# EAGLE design ThunderBolt Nova Pico (EAGLE 7.5.0)
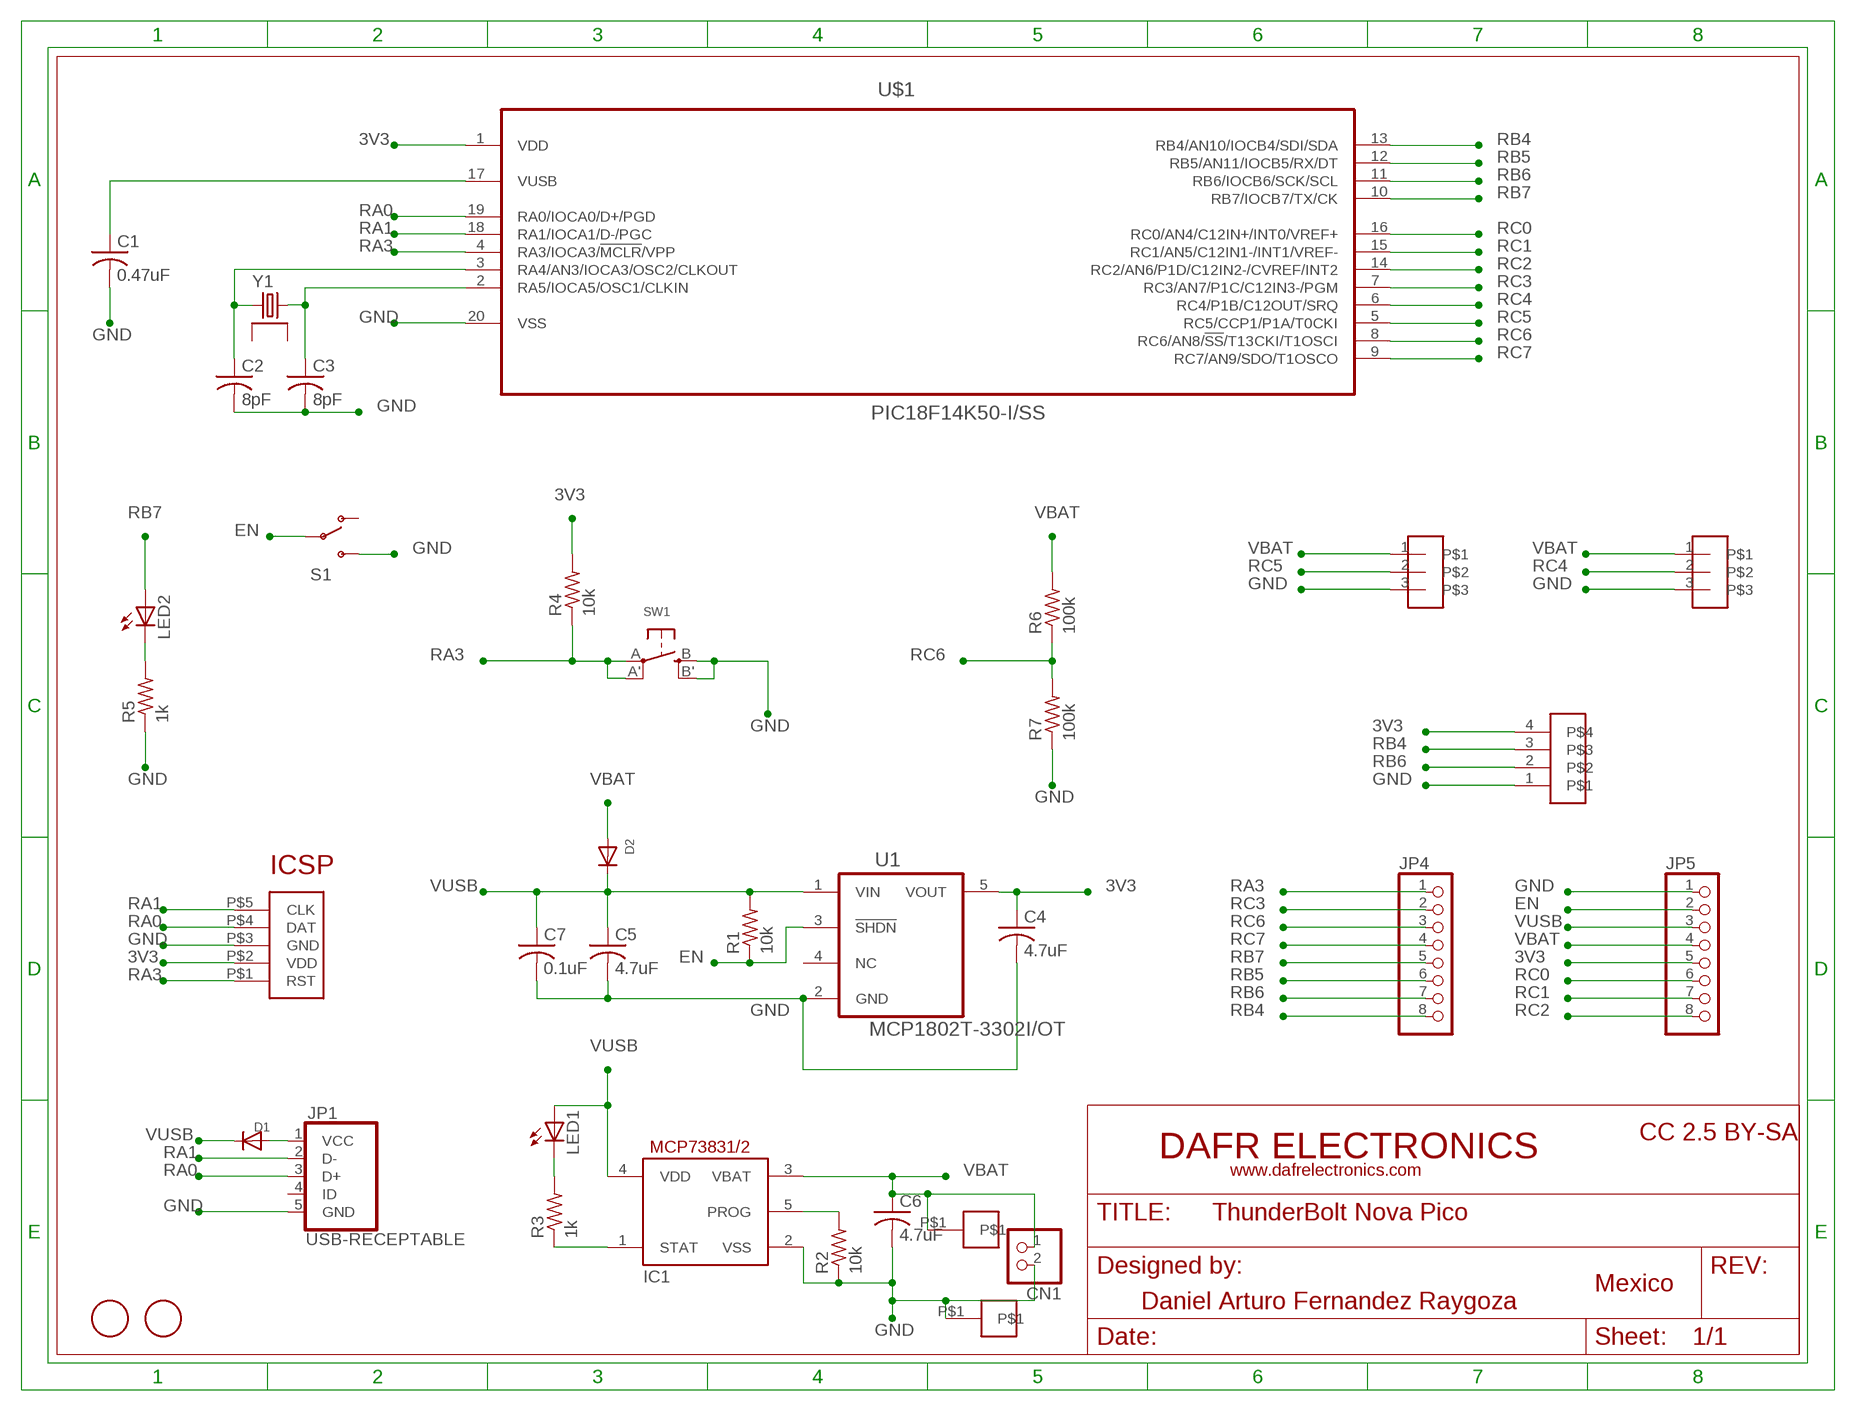
[diagram p0: schematic, sheet 1]

## Parts
C1  0.47uF  C-USC0805K  [C0805K]
C2  8pF  C-USC0805K  [C0805K]
C3  8pF  C-USC0805K  [C0805K]
C4  4.7uF  C-USC0805K  [C0805K]
C5  4.7uF  C-USC0805K  [C0805K]
C6  4.7uF  C-USC0805K  [C0805K]
C7  0.1uF  C-USC0603K  [C0603K]
CN1  JST_2PIN-SMT-RA  [JST-PH-2-SMT-RA]
D1  DIODESOD-123  [SOD-123]
D2  DIODESOD-123  [SOD-123]
IC1  MCP73831/OT  [SOT23-5L]
JP1  USB-RECEPTABLE  [FCI-10103594-0001LF]
JP4  PINHD-1X8BIG  [1X08-BIG]
JP5  PINHD-1X8BIG  [1X08-BIG]
LED1  LEDCHIPLED_1206  [CHIPLED_1206]
LED2  LEDCHIPLED_1206  [CHIPLED_1206]
R1  10k  R-US_R0805  [R0805]
R2  10k  R-US_R0805  [R0805]
R3  1k  R-US_R0805  [R0805]
R4  10k  R-US_R0805  [R0805]
R5  1k  R-US_R0805  [R0805]
R6  100k  R-US_R0805  [R0805]
R7  100k  R-US_R0805  [R0805]
S1  SWITCH-SPDT-SMD-A  [SWITCH-SPST-SMD-A]
SW1  SWITCH_TACT_SMT4.6X2.8  [BTN_KMR2_4.6X2.8]
U1  MCP1802T-3302I/OT  [SOT95P270X145-5N]
U$1  PIC18F14K50-I/SS  [SOP65P780X200-20N]
U$2  ICSP_POGO  [ICSP_POGO]
U$3  PADSMD  [PADSMD]
U$4  PADSMD  [PADSMD]
U$5  PIN1X3  [PIN1X3]
U$6  PIN1X3  [PIN1X3]
U$7  PIN1X4  [PIN1X4]
U$8  FIDUCIAL  [FIDUCIAL_1MM]
U$9  FIDUCIAL  [FIDUCIAL_1MM]
Y1  GRX-330  [OSC3225]

## Nets
3V3: C4.1 JP5.5 R4.2 U1.5(VOUT) U$1.1(VDD) U$2.P$2(VDD) U$7.4
EN: JP5.2 R1.1 S1.2(P) U1.3(!SHDN)
GND: C1.2 C2.2 C3.2 C4.2 C5.2 C6.2 C7.2 CN1.2 IC1.2(VSS) JP1.5(GND) JP5.1 R2.1 R5.1 R7.1 S1.3(S) SW1.B'(S1) SW1.B(S) U1.2(GND) U$1.20(VSS) U$2.P$3(GND) U$3.P$1 U$5.3 U$6.3 U$7.1
N$4: C1.1 U$1.17(VUSB)
N$6: C2.1 U$1.3(RA4/AN3/IOCA3/OSC2/CLKOUT) Y1.P$1
N$7: C3.1 U$1.2(RA5/IOCA5/OSC1/CLKIN) Y1.P$3
N$8: D1.A JP1.1(VCC)
N$11: IC1.1(STAT) R3.1
N$12: LED1.C R3.2
N$14: IC1.5(PROG) R2.2
N$15: LED2.C R5.2
RA0: JP1.3(D+) U$1.19(RA0/IOCA0/D+/PGD) U$2.P$4(DAT)
RA1: JP1.2(D-) U$1.18(RA1/IOCA1/D-/PGC) U$2.P$5(CLK)
RA3: JP4.1 R4.1 SW1.A'(P1) SW1.A(P) U$1.4(RA3/IOCA3/!MCLR!/VPP) U$2.P$1(RST)
RB4: JP4.8 U$1.13(RB4/AN10/IOCB4/SDI/SDA) U$7.3
RB5: JP4.6 U$1.12(RB5/AN11/IOCB5/RX/DT)
RB6: JP4.7 U$1.11(RB6/IOCB6/SCK/SCL) U$7.2
RB7: JP4.5 LED2.A U$1.10(RB7/IOCB7/TX/CK)
RC0: JP5.6 U$1.16(RC0/AN4/C12IN+/INT0/VREF+)
RC1: JP5.7 U$1.15(RC1/AN5/C12IN1-/INT1/VREF-)
RC2: JP5.8 U$1.14(RC2/AN6/P1D/C12IN2-/CVREF/INT2)
RC3: JP4.2 U$1.7(RC3/AN7/P1C/C12IN3-/PGM)
RC4: U$1.6(RC4/P1B/C12OUT/SRQ) U$5.2
RC5: U$1.5(RC5/CCP1/P1A/T0CKI) U$6.2
RC6: JP4.3 R6.1 R7.2 U$1.8(RC6/AN8/!SS!/T13CKI/T1OSCI)
RC7: JP4.4 U$1.9(RC7/AN9/SDO/T1OSCO)
VBAT: C6.1 CN1.1 D2.A IC1.3(VBAT) JP5.4 R6.2 U$4.P$1 U$5.1 U$6.1
VUSB: C5.1 C7.1 D1.C D2.C IC1.4(VDD) JP5.3 LED1.A R1.2 U1.1(VIN)
Unconnected: JP1.4(ID) S1.1(O) U1.4(NC) Y1.P$2 Y1.P$4

## Library data of the parts
C1-C7 = adafruit:C-US: CAPACITOR, American symbol
CN1 = adafruit:JST_2PIN: JST 2-Pin Connectors of various flavors SMT-RA (S2B-PH-SM4) 4UConnector #17311 SMT (B2B-PH-SM4) THM-RA (S2B-PH) THM (B2B-PH)
D1 D2 = adafruit:DIODE: Diode SMADIODE - SMA Surface Mount Package 20V 1A Schottky Diode Digikey: 641-1014-6-ND DO-1N4148 - Through Hole Small Current Diode SOD-123 20V 1 A (.5mV Vf) Schottky Diode - Digikey: MBRX120TPMSCT-ND SOD-323 10V 570mA (.38mV Vf, 3ns) Schottky Diode - Digikey: ZLLS410CT-ND SOD-523 30V 30mA Schottky Diode (RB751S-40TE61) - Digikey: RB751S-40TE61CT-ND SOT23-R/W - SOT23 Package (R = Solder Paste/Reflow Ovens, W = Hand-Soldering) BAT54Film 40V 300mA - Digikey: 497-7162-1-ND
IC1 = adafruit:MCP73831: MCP73831/2 Miniature Single-Cell, Fully Integrated Li-Ion, Li-Polymer Charge Management Controllers. Nice and small simple lipoly charge controller, with adjustable current and status output (LED) http://www.ladyada.net/library/pcb/eaglelibrary.html
JP1 = daspilker:USB-RECEPTABLE: USB Receptable
JP4 JP5 = adafruit:PINHD-1X8: PIN HEADER
LED1 LED2 = adafruit:LED: LED OSRAM: - CHIPLED LG R971, LG N971, LY N971, LG Q971, LY Q971, LO R971, LY R971 LH N974, LH R974 LS Q976, LO Q976, LY Q976 LO Q996 - Hyper CHIPLED LW Q18S LB Q993, LB Q99A, LB R99A - SideLED LS A670, LO A670, LY A670, LG A670, LP A670 LB A673, LV A673, LT A673, LW A673 LH A674 LY A675 LS A676, LA A676, LO A676, LY A676, LW A676 LS A679, LY A679, LG A679 - Hyper Micro SIDELED® LS Y876, LA Y876, LO Y876, LY Y876 LT Y87S - SmartLED LW L88C, LW L88S LB L89C, LB L89S, LG L890 LS L89K, LO L89K, LY L89K LS L896, LA L896, LO L896, LY L896 - TOPLED LS T670, LO T670, LY T670, LG T670, LP T670 LSG T670, LSP T670, LSY T670, LOP T670, LYG T670 LG T671, LOG T671, LSG T671 LB T673, LV T673, LT T673, LW T673 LH T674 LS T676, LA T676, LO T676, LY T676, LB T676, LH T676, LSB T676, LW T676 LB T67C, LV T67C, LT T67C, LS T67K, LO T67K, LY T67K, LW E67C LS E67B, LA E67B, LO E67B, LY E67B, LB E67C, LV E67C, LT E67C LW T67C LS T679, LY T679, LG T679 LS T770, LO T770, LY T770, LG T770, LP T770 LB T773, LV T773, LT T773, LW T773 LH T774 LS E675, LA E675, LY E675, LS T675 LS T776, LA T776, LO T776, LY T776, LB T776 LHGB T686 LT T68C, LB T68C - Hyper Mini TOPLED® LB M676 - Mini TOPLED Santana® LG M470 LS M47K, LO M47K, LY M47K Source: http://www.osram.convergy.de/
R1-R7 = adafruit:R-US_: RESISTOR, American symbol
S1 = SparkFun-Electromechanical:SWITCH-SPDT: SPDT Switch Simple slide switch, Spark Fun Electronics SKU : COM-00102 DPDT SMT slide switch, AYZ0202, SWCH-08179
SW1 = microbuilder:SWITCH_TACT_SMT: SMT Tact Switches 6x6mm - Digikey: P12940SCT-ND KMR2 (4.6x2.8mm) - Digikey: 401-1426-1-ND EVQ-PQHB55 - Light Touch, 160GF (4.5x4.5mm) - Digikey: P8090SCT-ND KMT0 - KMT021 NGJ LHS (etc.) IP68/Waterproof - Digikey: CKN10289CT-ND
U1 = Microchip-MCP1802T-3302I_OT:MCP1802T-3302I/OT: 300 mA, High PSRR, Low Quiescent Current LDO, SOT23-5; MPN: MCP1802T-3302I/OT; OC_FARNELL: Unknown; OC_NEWARK: 54M4838; PACKAGE: SOT23-5; SUPPLIER: Microchip
U$1 = PIC 18F14K50:PIC18F14K50-I/SS: USB Flash Microcontrollers; MPN: PIC18F14K50-I/SS; OC_FARNELL: 1648504; OC_NEWARK: 77M3105; PACKAGE: SOP-20; SUPPLIER: Microchip
U$2 = ICSP_POGO:ICSP_POGO
U$3 U$4 = 2brobots:PADSMD
U$5 U$6 = pines 2brobots:PIN1X3
U$7 = pines 2brobots:PIN1X4
U$8 U$9 = adafruit:FIDUCIAL: For use by pick and place machines to calibrate the vision/machine, 1mm By microbuilder.eu
Y1 = golledge_full_v1-0:GRX-330: Crystal |SM| 3.2 x 2.5 mm | AT cut | Frequency Range 12 - 40 MHz AEC-Q200 qualified for automotive applications Vacuum seal for excellent long-term stability High reliability at low cost Metal lid grounded to minimise EMI Datasheet <http://www.golledge.com/docs/products/xtl_sm/grx330.htm?src=eagle>; HEIGHT: 0.8

## Board
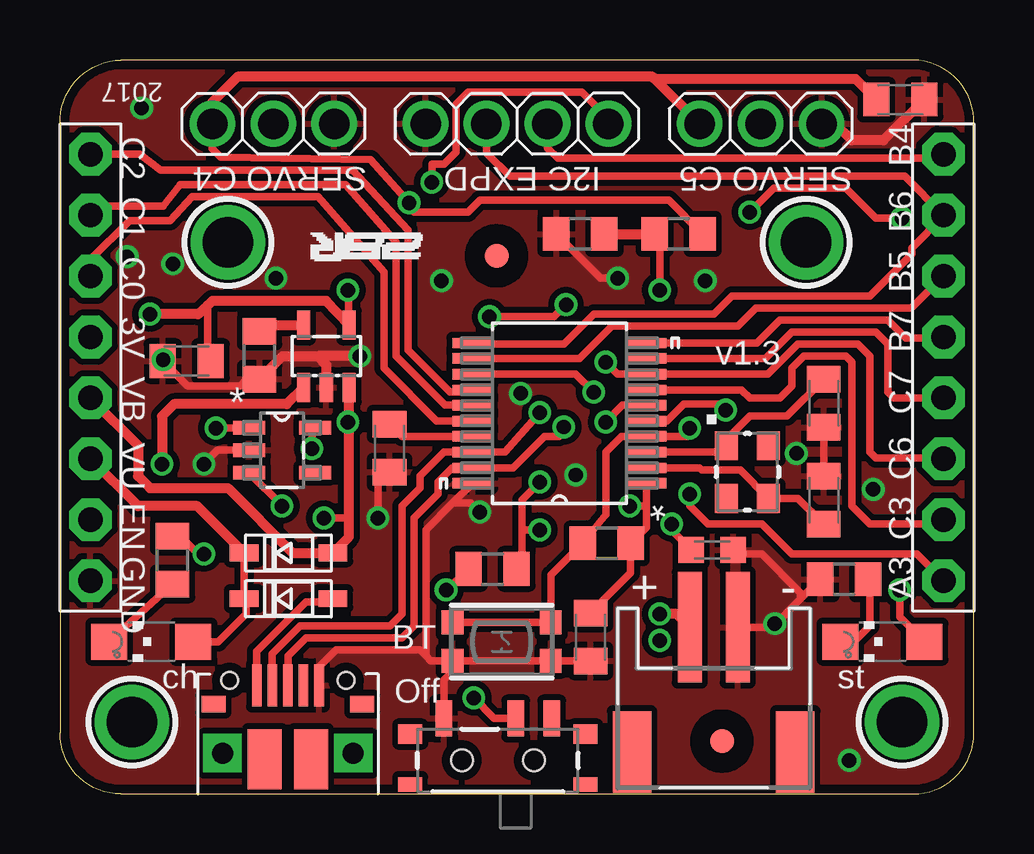
[diagram p1: board, top side]
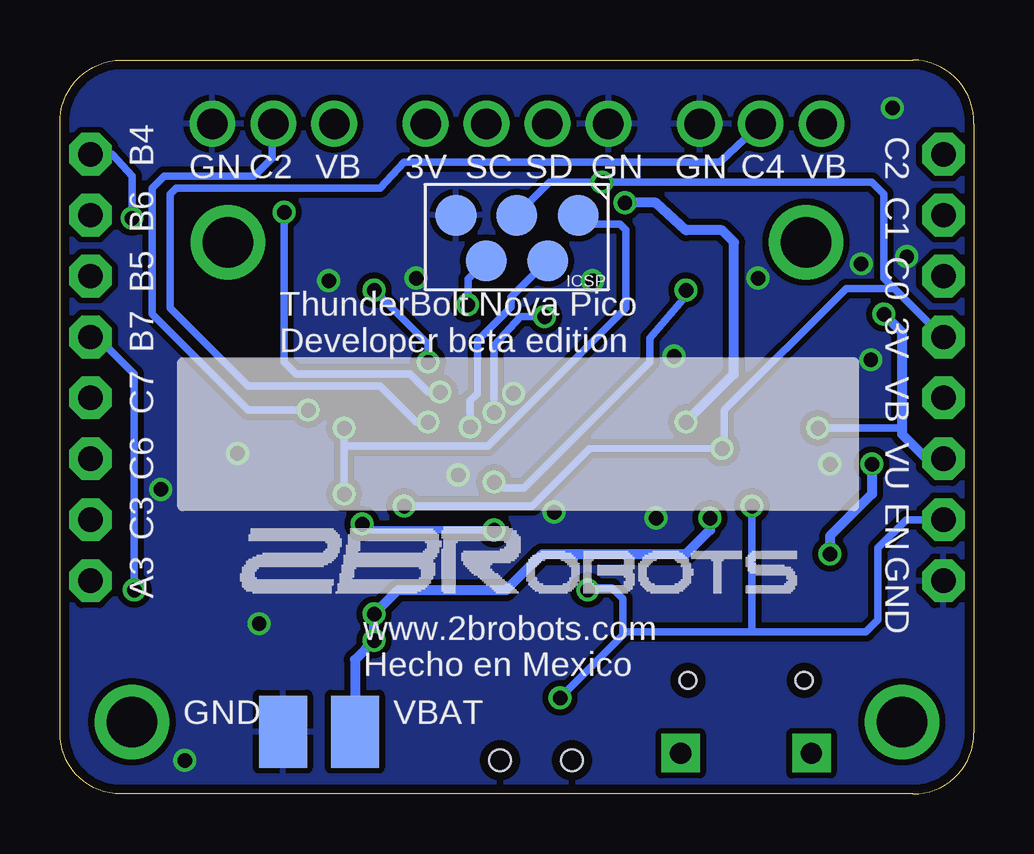
[diagram p2: board, bottom side, seen from below]

Size 38.1 x 30.6 mm. Coordinates in mm from the lower left corner, seen from the top.
Outline: 2.54,0 35.56,0 arc90 38.1,2.54 38.1,27.94 arc90 35.56,30.6 2.54,30.6 arc90 0,27.94 0,2.54 arc90 2.54,0
Copper layers (1*16): Top 0.0356mm / dielectric 1.5011mm / Bottom 0.0356mm
Design rules "oshpark-2layer *": minimum track width 6mil, minimum drill 13mil, track to track 6mil, track to pad 6mil, pad to pad 6mil, via to via 6mil, smd to smd 6mil, copper to edge 15mil, drill to drill 6mil, minimum pad ring 7mil, minimum via ring 7mil, stop-mask expansion 2.5mil, vias tented up to drill 50mil, thermal gap 10mil

### Footprints (pad centres in the part's own frame; a part is rotated, then mirrored left to right if it is on the bottom)
C0805K = smd 1.1 x 1.4: 1 -1,0; 2 1,0
C0603K = smd 1.05 x 1.08: 1 -0.875,0; 2 0.875,0
JST-PH-2-SMT-RA = smd 1 x 4.6: 1 1,-3.7; 2 -1,-3.7 | smd 1.6 x 3.4: NC1 -3.4,1.5; NC2 3.4,1.5
SOD-123 = smd 1.2 x 0.7: A 1.85,0; C -1.85,0
SOT23-5L = smd 0.55 x 1.2: 1 -0.95,-1.3; 2 0,-1.3; 3 0.95,-1.3; 4 0.95,1.3; 5 -0.95,1.3
FCI-10103594-0001LF = smd 0.4 x 1.75: 1 -1.3,4.525; 2 -0.65,4.525; 3 0,4.525; 4 0.65,4.525; 5 1.3,4.525 | smd 1 x 0.7: P$1 3.1,3.75; P$6 -3.1,3.75 | smd 1.425 x 2.5: P$2 0.963,1.45; P$5 -0.963,1.45 | drill 0.88 pad 1.6 square: P$3 -2.725,1.7; P$4 2.725,1.7 | hole 0.7: -2.425,4.73; 2.425,4.73
1X08-BIG = drill 1.016 pad 1.778 octagon: 1 -8.89,0; 2 -6.35,0; 3 -3.81,0; 4 -1.27,0; 5 1.27,0; 6 3.81,0; 7 6.35,0; 8 8.89,0
CHIPLED_1206 = smd 1.5 x 1.5: A 0,-1.75; C 0,1.75
R0805 = smd 1.1 x 1.4: 1 -1,0; 2 1,0
SWITCH-SPST-SMD-A = smd 0.7 x 1.5: 1 -2.25,-1.75; 2 -0.75,-1.75; 3 2.25,-1.75 | smd 1 x 0.6: GND1 -3.65,1; GND3 3.65,1 | smd 1 x 0.8: GND2 -3.65,-1.1; GND4 3.65,-1.1 | hole 0.9: -1.5,0; 1.5,0
BTN_KMR2_4.6X2.8 = smd 0.9 x 1: A 2.05,0.8; A' -2.05,0.8; B 2.05,-0.8; B' -2.05,-0.8
SOT95P270X145-5N = smd 1.321 x 0.559: 1 -1.372,0.94; 2 -1.372,0; 3 -1.372,-0.94; 4 1.372,-0.94; 5 1.372,0.94
SOP65P780X200-20N = smd 1.651 x 0.432: 1 -3.632,2.921; 2 -3.632,2.286; 3 -3.632,1.626; 4 -3.632,0.965; 5 -3.632,0.33; 6 -3.632,-0.33; 7 -3.632,-0.965; 8 -3.632,-1.626; 9 -3.632,-2.286; 10 -3.632,-2.921; 11 3.632,-2.921; 12 3.632,-2.286; 13 3.632,-1.626; 14 3.632,-0.965; 15 3.632,-0.33; 16 3.632,0.33; 17 3.632,0.965; 18 3.632,1.626; 19 3.632,2.286; 20 3.632,2.921
ICSP_POGO = smd 1.7 x 1.7: P$1 -2.55,0; P$2 0.01,0; P$3 2.54,0; P$4 -1.275,1.9; P$5 1.275,1.9
PADSMD = smd 2 x 3 bottom: P$1 0,0
PIN1X3 = drill 1.27: 1 -2.54,0; 2 0,0; 3 2.54,0
PIN1X4 = drill 1.27: 1 -3.81,0; 2 -1.27,0; 3 1.27,0; 4 3.81,0
FIDUCIAL_1MM = smd 1 x 1: 1 0,0
OSC3225 = smd 1.2 x 0.95: P$1 -1.1,-0.875; P$2 1.1,-0.875; P$3 1.1,0.875; P$4 -1.1,0.875

### Placement (x,y rotation side)
C1  13.74,14.42 270 top
C2  31.84,16.28 270 top
C3  31.84,12.25 90 top
C4  22.12,6.54 270 top
C5  5.28,18.05 180 top
C6  35.03,28.95 0 top
C7  27.19,10.17 0 top
CN1  27.25,3.25 180 top
D1  9.53,8.14 0 top
D2  9.53,10.04 0 top
IC1  11.1,18.25 0 top
JP1  9.5,0 0 top
JP4  36.83,17.78 90 top
JP5  1.27,17.78 90 top
LED1  3.81,6.35 90 top
LED2  34.29,6.35 90 top
R1  18.03,9.38 0 top
R2  8.32,18.29 90 top
R3  4.69,9.75 270 top
R4  22.79,10.45 0 top
R5  32.69,8.95 0 top
R6  25.79,23.35 0 top
R7  21.69,23.35 0 top
S1  18.25,1.4 180 top
SW1  18.41,6.35 0 top
U1  9.26,14.33 0 top
U$1  20.82,15.88 180 top
U$2  19.05,24.13 180 bottom
U$3  28.8,2.6 0 top
U$4  25.8,2.6 0 top
U$5  8.89,27.94 0 top
U$6  29.21,27.94 0 top
U$7  19.05,27.94 0 top
U$8  27.6,2.2 0 top
U$9  18.2,22.43 0 top
Y1  28.66,13.42 270 top

### Tracks (layer width: path | path; a pad name or v marks a point on that pad's centre or on a via)
3V3  (via drill 0.6)
  Top 0.305: 24.45,12 24.45,11.11 R4.2 23.79,9.21 C4.1 | 24.45,12 U$1.1 | U$7.4 22.86,28.14 21.75,29.25 17,29.25 16.5,28.75 16.5,26.75 16,26.25 15.5,26.25 v15.5,25.5 | U1.5 10.5,15.14 v10.5,14.4 | v23.75,12 24.45,12
  Bottom 0.305: U$2.P$2 17.69,25.5 v15.5,25.5 4.25,25.5 3.75,25 3.75,21.5 3.33,21.07 | 3.33,21.07 1.3,19.05 JP5.5 | v23.75,12 18.4,12 16,14.4 v10.5,14.4 10.5,14.75 10.4,14.85 10.4,16 5.33,21.07 3.33,21.07
EN  (via drill 0.6)
  Top 0.305: v17.25,4 18.1,3.15 S1.2 | U1.3 9.25,12.03 v9.25,12 | R1.1 16.65,9 v16.1,8.5
  Bottom 0.305: v17.25,4 14.62,6.62 | 14.62,6.62 14.5,6.75 9.25,6.75 | 9.25,6.75 4.5,6.75 4,7.25 4,10.25 2.82,11.43 JP5.2 | v9.25,12 9.25,6.75 | 14.62,6.62 14.62,8.12 15.1,8.6 15.9,8.6 v16.1,8.5
GND  (via drill 0.6)
  Top 0.305: S1.3 16,4.75 16.36,5.12 SW1.B' | SW1.B' SW1.B C4.2 | U$1.20 16.37,12.13 | 16.37,12.13 15.25,11.02 15.25,5.75 | 15.25,5.75 15.45,5.55 SW1.B' | C3.2 C2.2 | 15.25,5.75 15,6 11.5,6 10.8,5.3 JP1.5 | R5.1 30.87,8.13 | 30.87,8.13 29.69,6.95 CN1.2 | C1.2 13.25,12.93 v13.25,11.5 | v17.5,11.75 17.12,12.13 16.37,12.13 | R7.1 22.54,21.5 v23.25,21.5 | C7.2 28.23,10 29.25,10 30.87,8.38 30.87,8.13 | C5.2 5.33,17 7.5,17 7.79,17.29 R2.1 | v6,13.75 6.58,14.33 U1.2
  Top 0.406: R2.1 9.28,18.25 10.75,18.25 | 10.75,18.25 11.1,17.9 IC1.2 | v12.5,18.25 10.75,18.25 | C6.2 34.33,27.25 33,27.25 32.31,27.94 U$6.3
  other vias: 3.4,28.6 26.9,21.4 32.9,1.4 33.9,12.7 30.7,14.2 9,21.5 2.8,22.4 21.5,13.3 15.9,21.4 19.2,16.7 4.3,18.1 4.7,22.1 29.8,7.1
  pour Bottom (isolate 0.255): 0,30.48 0,0 38.1,0 38.1,30.48
  pour Top (isolate 0.255): 0,30.48 0,0 38.1,0 38.1,30.48
N$1  (via drill 2.1 pad 2.54)
  other vias: 7,23
N$2  (via drill 2.1 pad 2.54)
  other vias: 31.1,23
N$3  (via drill 2.1 pad 2.54)
  other vias: 3,3
N$4
  Top 0.305: C1.1 14.25,14.91 U$1.17
N$5  (via drill 2.1 pad 2.54)
  other vias: 35.1,3
N$6
  Top 0.305: U$1.3 27.51,14.25 Y1.P$1 27.79,14.79 28.75,15.75 30.31,15.75 C2.1
N$7
  Top 0.305: U$1.2 26.66,13.59 26.75,13.5 28.36,13.5 Y1.P$3 30.77,12.32 C3.1
N$8
  Top 0.305: D1.A 11.23,8 10.25,8 8.2,5.95 JP1.1
N$11  (via drill 0.6)
  Top 0.305: R3.1 4.94,10.5 5.25,10.5 5.75,10 v6,10
  Top 0.406: IC1.1 9.45,16.25 4.75,16.25 4.25,15.75 v4.25,13.75
  Bottom 0.406: v4.25,13.75 4.25,12.5 6,10.75 v6,10
N$12
  Top 0.305: R3.2 2.06,6.37 LED1.C
N$14
  Top 0.406: R2.2 8.58,19.55 IC1.5
N$15
  Top 0.305: R5.2 33.75,8.89 33.75,7 33.1,6.35 LED2.C
RA0  (via drill 0.6)
  Top 0.305: JP1.3 9.5,5.75 10.25,6.5 14.25,6.5 14.75,7 14.75,11.5 15.75,12.5 15.75,13 16.34,13.59 U$1.19 18.89,13.59 20.2,14.9 20.8,14.9 v21,15.3
  Bottom 0.305: U$2.P$4 19.3,20.7 19.3,20.3 20.7,18.9 20.7,16.7 21,16.4 v21,15.3
RA1  (via drill 0.6)
  Top 0.305: JP1.2 8.85,5.85 10,7 13.75,7 14.25,7.5 14.25,12 15,12.75 15,13.25 16,14.25 U$1.18 18.55,14.25 v20,15.9 | v21.1,20.4 20.6,19.9 v17.9,19.9
  Bottom 0.305: U$2.P$5 21.1,21.45 v21.1,20.4 | v17.9,19.9 18.9,19.9 20,18.7 v20,15.9
RA3  (via drill 0.6)
  Top 0.305: SW1.A' SW1.A 20.46,9.12 R4.1 22.75,11.66 22.75,14.25 23.41,14.91 U$1.4 26.16,14.91 v26.25,15.25 | JP4.1 35.72,10 30.5,10 29.25,11.25 27,11.25 26.25,12 v26.25,12.5
  Bottom 0.305: v26.25,12.5 26.25,14.5 | 26.25,14.5 v26.25,15.25 | U$2.P$1 16.12,23.75 14.75,23.75 14.5,23.5 14.5,20.25 20.25,14.5 26.25,14.5
RB4  (via drill 0.6)
  Top 0.305: JP4.8 36.66,26.5 20.75,26.5 20.32,26.93 U$7.3 | U$1.13 21.5,17.5 v22.25,16.75 | v28.75,24.25 29.75,25.25 32.75,25.25 34,24 v35.1,24
  Bottom 0.305: v35.1,24 35.1,25.75 35.92,26.67 JP4.8 | v28.75,24.25 28.75,18 28.25,17.5 23.5,17.5 22.75,16.75 v22.25,16.75
RB5
  Top 0.305: JP4.6 35.49,20.25 29,20.25 28.25,19.5 23,19.5 21.66,18.16 U$1.12
RB6
  Top 0.305: U$7.2 17.78,26.72 18.75,25.75 35.21,25.75 JP4.7 36.83,24.08 35.5,22.75 35.5,22.5 33.75,20.75 28,20.75 27.25,20 22.25,20 21,18.75 17.23,18.75 U$1.11
RB7  (via drill 0.6)
  Top 0.305: JP4.5 36.78,19 35.25,19 34.5,19.75 30,19.75 29.05,18.8 U$1.10 | LED2.A 35,7.39 v35,8.5
  Bottom 0.305: v35,8.5 35,17.5 36.55,19.05 JP4.5
RC0
  Top 0.305: U$1.16 15.71,15.54 13.5,17.75 13.5,21.75 10.75,24.9 5.5,24.9 4.6,23.9 2.9,23.9 1.27,22.27 JP5.6
RC1
  Top 0.305: JP5.7 1.64,24.5 4.3,24.5 5,25.4 11.9,25.4 14,23 14,18.25 16.05,16.2 U$1.15
RC2
  Top 0.305: U$1.14 17.1,16.75 16.25,16.75 14.5,18.5 14.5,23.5 12.2,26 4.2,26 3.33,26.67 JP5.8
RC3
  Top 0.305: JP4.2 36.65,11.25 33.75,11.25 33,12 33,18 32.75,18.25 31,18.25 30.5,17.75 30.5,17 30,16.5 28.75,16.5 28.41,16.84 U$1.7
RC4  (via drill 0.6)
  Top 0.305: v22.75,15.5 23.45,16.2 U$1.6
  Bottom 0.305: U$5.2 10.58,26.35 23.75,26.35 24.75,25.25 33.25,25.25 33.5,25 33.5,20.25 30.25,17 24.75,17 23.25,15.5 v22.75,15.5
RC5  (via drill 0.6)
  Top 0.305: v27.75,16 27.5,16.25 26,16.25 25.3,15.54 U$1.5
  Bottom 0.305: U$6.2 29.25,27.9 29.25,26.5 30,25.75 33.75,25.75 34.25,25.25 34.25,20 30.25,16 v27.75,16
RC6  (via drill 0.6)
  Top 0.305: JP4.3 36.8,14 34,14 33.75,14.25 33.75,18.25 33.25,18.75 30.75,18.75 29.5,17.5 U$1.8 23.25,17.5 v22.75,18 | R6.1 25,23.14 v25,21
  Top 0.406: R7.2 R6.1
  Bottom 0.305: v25,21 22.75,18.75 v22.75,18
RC7
  Top 0.305: JP4.4 34.75,16.5 34.5,16.75 34.5,18.75 34,19.25 30.5,19.25 29.41,18.16 U$1.9
VBAT  (via drill 0.6)
  Top 0.305: R6.2 25.39,24.75 17.5,24.75 17,24.25 14.75,24.25 v14.55,24.65 12.95,26.45 6.7,26.55 6.35,26.9 U$5.1 | v11,11.5 12.05,11.5 | v12,15.5 12.05,15.55 IC1.3
  Top 0.406: IC1.3 12.05,11.5 12.05,10.72 D2.A 9.71,10.04 7,12.75 3.75,12.75 3.25,13.25 3.25,14.53 JP5.4 | U$6.1 24.8,29.8 | 24.8,29.8 24.71,29.9 7.4,29.9 6.35,28.85 U$5.1 | C6.1 33.17,29.8 24.8,29.8 | CN1.1 25.7,7.5 v25,7.5
  Bottom 0.406: v11,11.5 11,11 12,10 18,10 19.5,8.5 24,8.5 v25,7.5 v25,6.4 25.8,5.6 U$4.P$1 | v14.55,24.65 13.25,24.65 12,23.5 10.5,23.5 10,23 10,17.5 v12,15.5
VUSB  (via drill 0.6)
  Top 0.305: LED1.A 6.6,6.35 7.75,7.5 7.75,8.06 D1.C D2.C | U1.1 7.87,15.25 v6.5,15.25 | R1.2 19.25,9.6 19.25,11 | 19.25,11 19.25,12.25 v20,13 | v12,21 IC1.4 | C7.1 25.5,10.98 v25.5,11.25 | v20,11 19.25,11 | C5.1 6.15,18.18 6.15,20.36
  Top 0.406: IC1.4 11.1,20.55 6.35,20.55 6.15,20.36 5.75,20 v3.75,20 | D2.C 5.72,12 3.25,12 JP5.3
  Bottom 0.305: v6.5,15.25 3,15.25 | v20,13 19.75,12.75 18.75,12.75 13.5,18 13.5,19 12,20.75 v12,21 | v25.5,11.25 25.25,11 v20,11
  Bottom 0.406: v3.75,20 3,19.25 3,15.25 3,15 1.97,13.97 JP5.3

### Text on the board
tPlace: 2017 | B4 | C2 | SERVO C4 | I2C EXPD | SERVO C5 | C1 | B6 | B5 | C0 | 3V | B7 | v1.3 | C7 | VB | VU | C6 | EN | C3 | GND | A3 | BT | ch | Off | st
bPlace: B4 | C2 | VB | C4 | GN | GN | SD | SC | 3V | VB | C2 | GN | C1 | B6 | B5 | C0 | 3V | B7 | ThunderBolt Nova Pico / Developer beta edition | C7 | VB | VU | C6 | EN | C3 | GND | A3 | www.2brobots.com | Hecho en Mexico | VBAT | GND